# EAGLE design StepperSynth2.4_Motor (EAGLE 9.3.1)
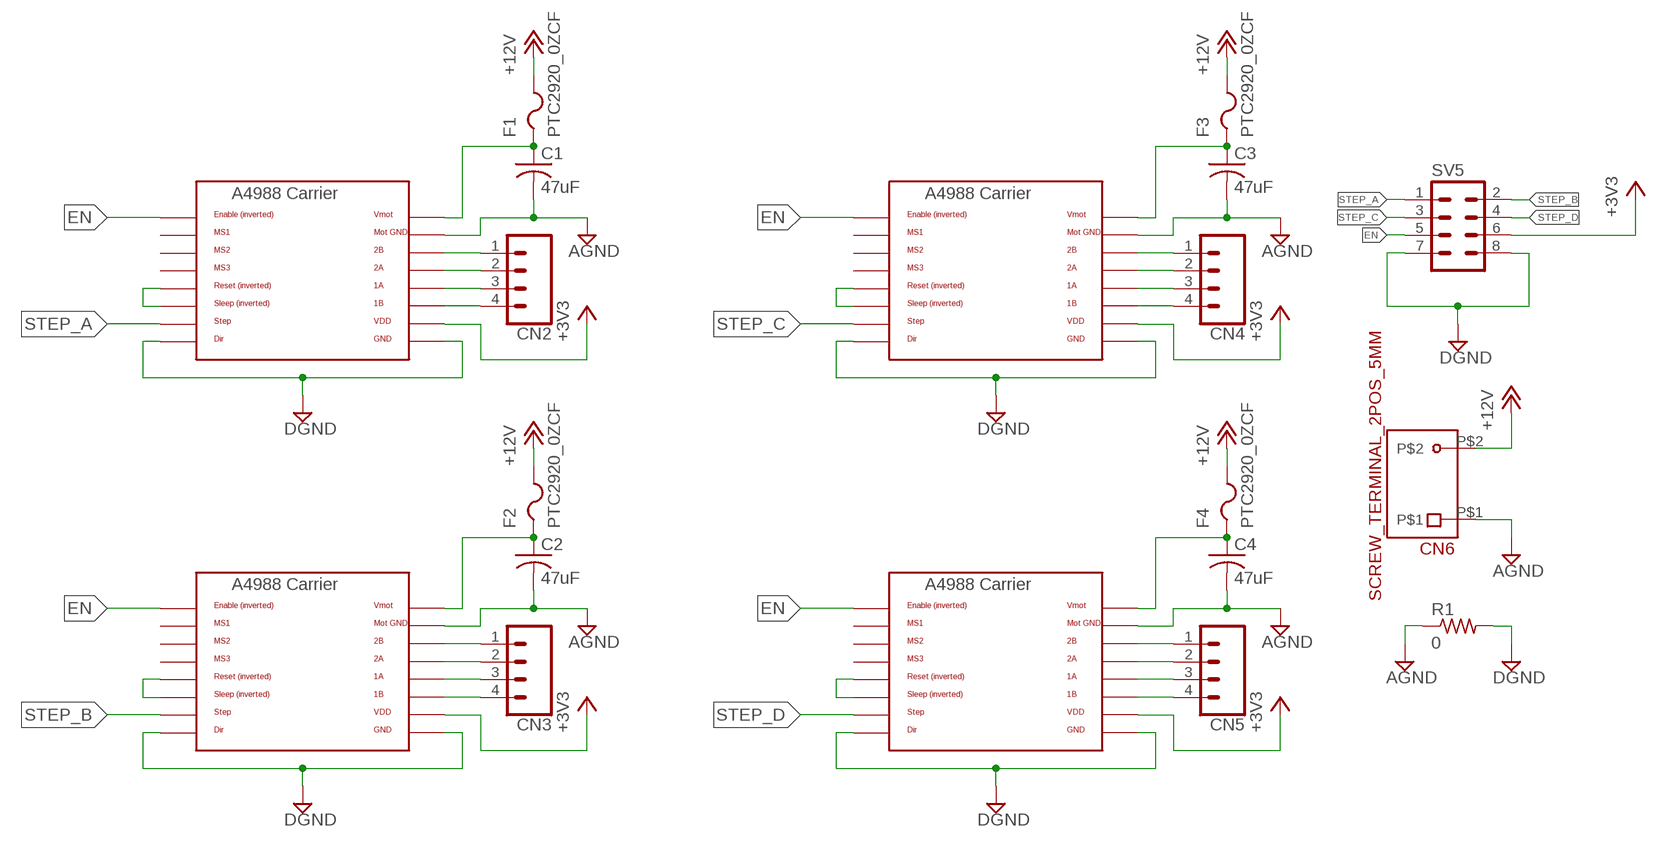
[diagram p0: schematic, sheet 1]

## Parts
C1  47uF  C_US_5_10  [E5-10]
C2  47uF  C_US_5_10  [E5-10]
C3  47uF  C_US_5_10  [E5-10]
C4  47uF  C_US_5_10  [E5-10]
CN2  CONN_04_LOCK  [1X04_LOCK_LONGPADS]
CN3  CONN_04_LOCK  [1X04_LOCK_LONGPADS]
CN4  CONN_04_LOCK  [1X04_LOCK_LONGPADS]
CN5  CONN_04_LOCK  [1X04_LOCK_LONGPADS]
CN6  SCREW_TERMINAL_2POS_5MM  [2_POS_SCREW_TERM]
F1  PTC2920_0ZCF  [0ZCF]
F2  PTC2920_0ZCF  [0ZCF]
F3  PTC2920_0ZCF  [0ZCF]
F4  PTC2920_0ZCF  [0ZCF]
R1  0  R-US_0207/15  [0207/15]
SV5  CONN_4X2_LOCK4X2_LOCK  [CONN_4X2_LOCK]
U$1  A4988BREAKOUT  [A4988BREAKOUT]
U$2  A4988BREAKOUT  [A4988BREAKOUT]
U$3  A4988BREAKOUT  [A4988BREAKOUT]
U$4  A4988BREAKOUT  [A4988BREAKOUT]

## Nets
+3V3: SV5.6 U$1.VDD U$2.VDD U$3.VDD U$4.VDD
+12V: CN6.P$2 F1.2 F2.2 F3.2 F4.2
AGND: C1.- C2.- C3.- C4.- CN6.P$1 R1.1 U$1.MOTGND U$2.MOTGND U$3.MOTGND U$4.MOTGND
DGND: R1.2 SV5.7 SV5.8 U$1.DIR U$1.GND U$2.DIR U$2.GND U$3.DIR U$3.GND U$4.DIR U$4.GND
EN: SV5.5 U$1.EN U$2.EN U$3.EN U$4.EN
N$1: CN2.1 U$1.2B
N$2: CN2.2 U$1.2A
N$3: CN2.3 U$1.1A
N$4: CN2.4 U$1.1B
N$5: U$1.RST U$1.SLP(SLEEP)
N$6: C1.+ F1.1 U$1.VMOT
N$7: CN3.1 U$2.2B
N$8: CN3.2 U$2.2A
N$9: CN3.3 U$2.1A
N$10: CN3.4 U$2.1B
N$11: U$2.RST U$2.SLP(SLEEP)
N$12: C2.+ F2.1 U$2.VMOT
N$13: CN4.1 U$3.2B
N$14: CN4.2 U$3.2A
N$15: CN4.3 U$3.1A
N$16: CN4.4 U$3.1B
N$17: U$3.RST U$3.SLP(SLEEP)
N$18: C3.+ F3.1 U$3.VMOT
N$19: CN5.1 U$4.2B
N$20: CN5.2 U$4.2A
N$21: CN5.3 U$4.1A
N$22: CN5.4 U$4.1B
N$23: U$4.RST U$4.SLP(SLEEP)
N$24: C4.+ F4.1 U$4.VMOT
STEP_A: SV5.1 U$1.STEP
STEP_B: SV5.2 U$2.STEP
STEP_C: SV5.3 U$3.STEP
STEP_D: SV5.4 U$4.STEP
Unconnected: U$1.MS1 U$1.MS2 U$1.MS3 U$2.MS1 U$2.MS2 U$2.MS3 U$3.MS1 U$3.MS2 U$3.MS3 U$4.MS1 U$4.MS2 U$4.MS3

## Library data of the parts
C1-C4 = Stepper Synth 2.4:C_US_5_10: Capacitor 5mm lead Spacing, 10mm Diameter
CN2-CN5 = Stepper Synth 2.4:CONN_04_LOCK
CN6 = Stepper Synth 2.4:SCREW_TERMINAL_2POS_5MM: 2 position screw terminal. 5mm spacing Digikey PN ED2561-ND
F1-F4 = Stepper Synth 2.4:PTC2920_0ZCF; MANUFACTURER_PART_NUMBER: 0ZCF0150FF2C; VENDOR: Belfuse
R1 = adafruit:R-US_: RESISTOR, American symbol
SV5 = Stepper Synth 2.4:CONN_4X2_LOCK
U$1-U$4 = Stepper Synth 2.4:A4988BREAKOUT

## Board
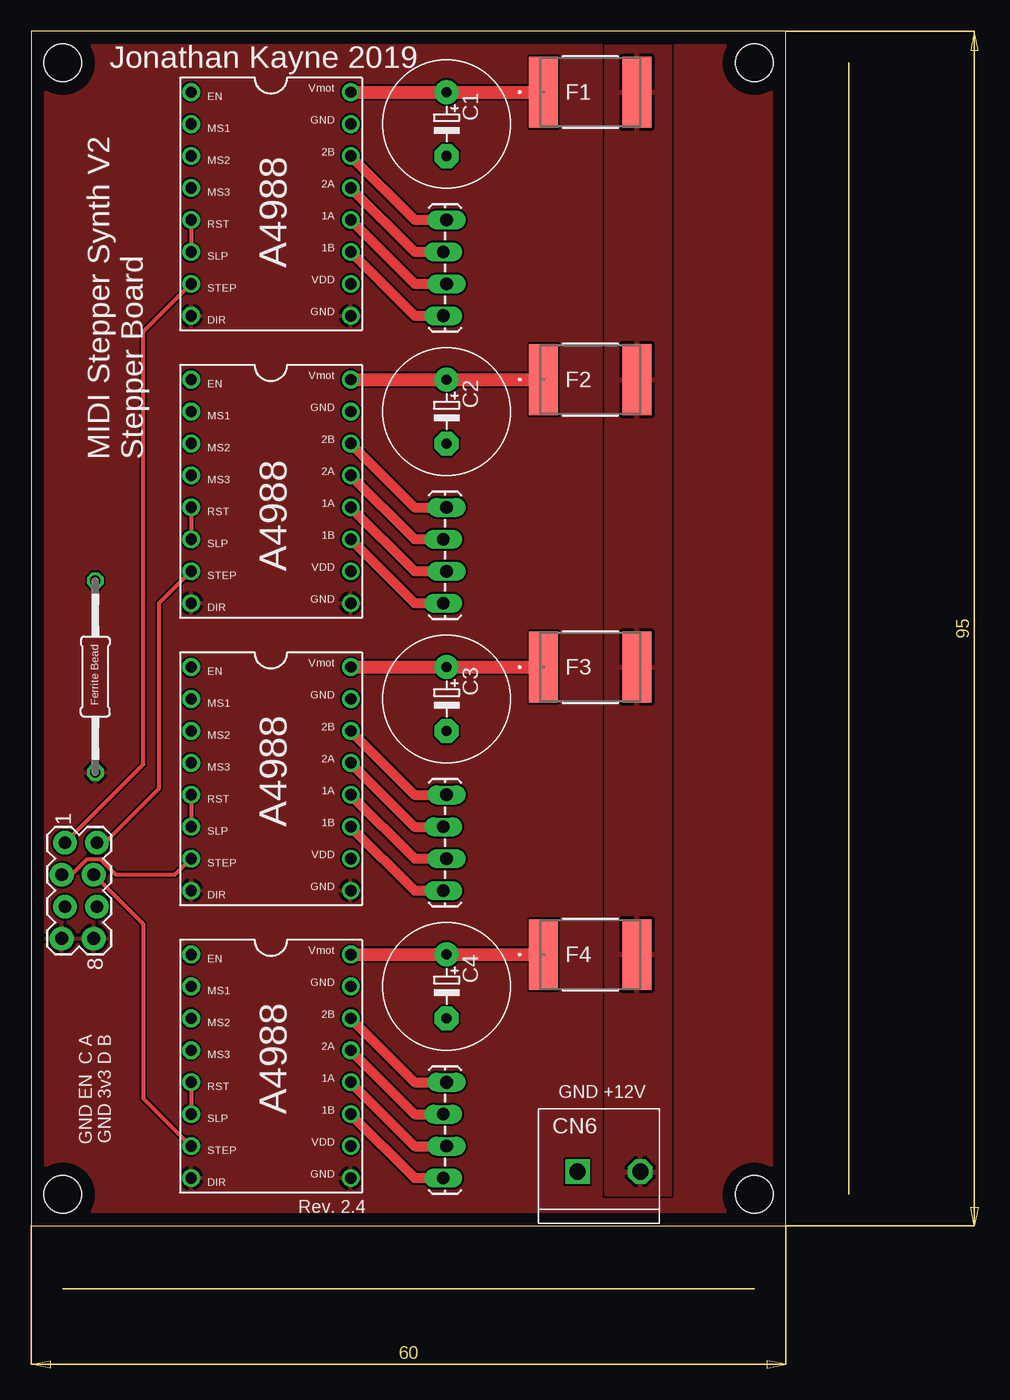
[diagram p1: board, top side]
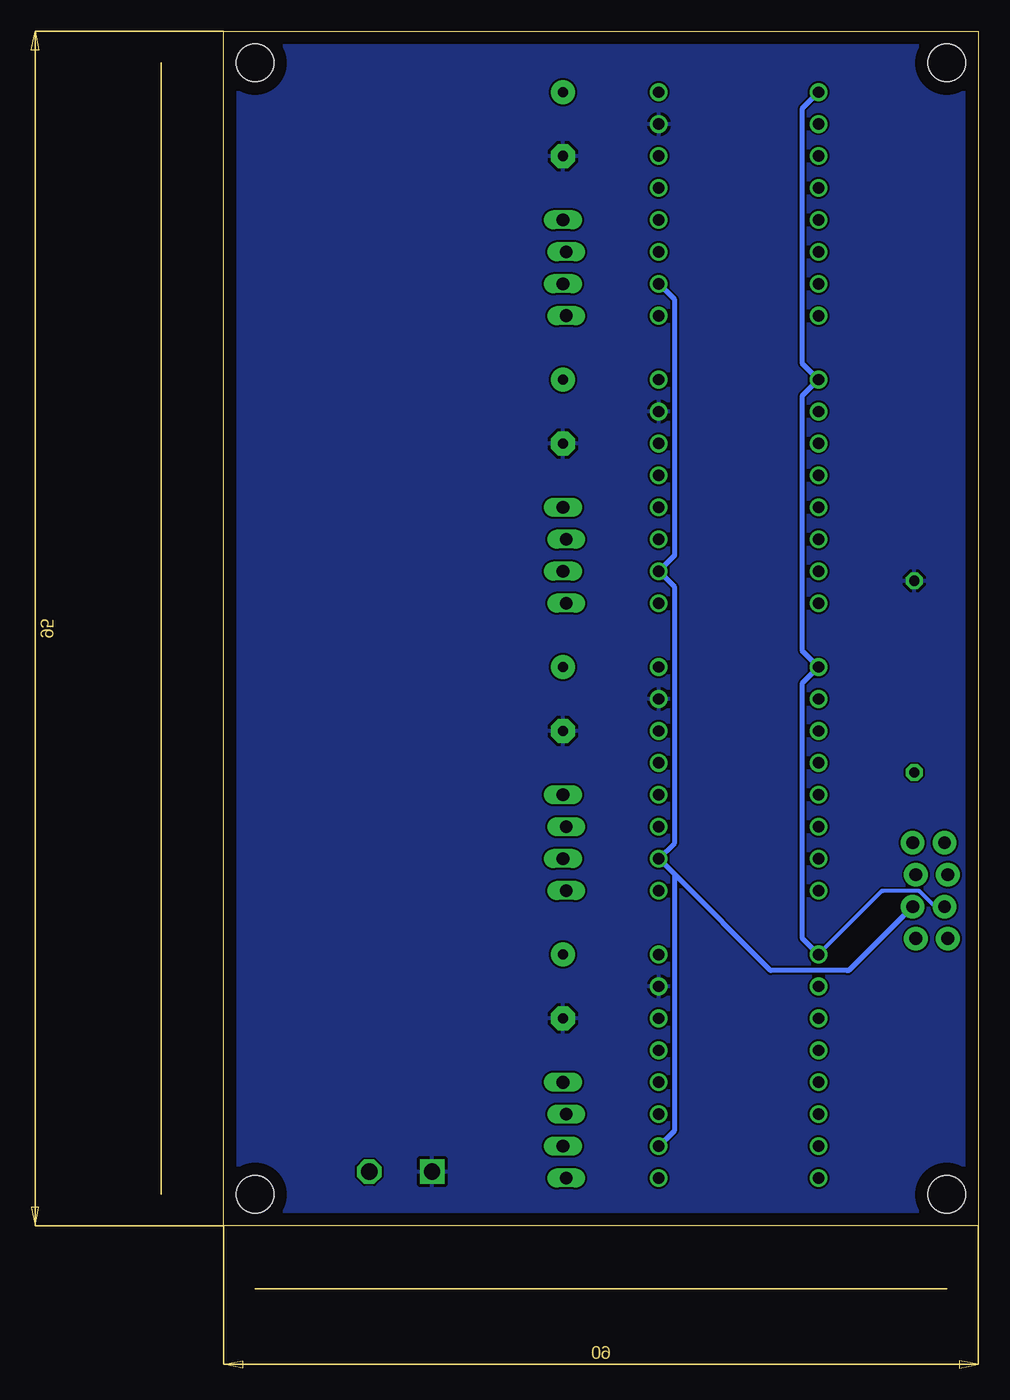
[diagram p2: board, bottom side, seen from below]

Size 60 x 95 mm. Coordinates in mm from the lower left corner, seen from the top.
Outline: 0,0 60,0 60,95 0,95 0,0
Copper layers (1*16): Top 0.035mm / dielectric 1.5mm / Bottom 0.035mm
Design rules "default": minimum track width 6mil, minimum drill 0.35mm, track to track 6mil, track to pad 6mil, pad to pad 6mil, via to via 6mil, smd to smd 6mil, copper to edge 40mil, drill to drill 6mil, minimum pad ring 10mil, minimum via ring 8mil, stop-mask expansion 4mil, vias tented up to drill 0mil, thermal gap 10mil
Holes 3 mm at 2.5,2.5 57.5,2.5 2.5,92.5 57.5,92.5

### Footprints (pad centres in the part's own frame; a part is rotated, then mirrored left to right if it is on the bottom)
E5-10 = drill 0.813 pad 1.905: + -2.54,0 | drill 0.813 pad 1.905 octagon: - 2.54,0
1X04_LOCK_LONGPADS = drill 1.016 long: 1 0,0; 2 2.54,-0.254; 3 5.08,0; 4 7.62,-0.254
2_POS_SCREW_TERM = drill 1.3 square: P$1 0,0 | drill 1.3 octagon: P$2 5,0
0ZCF = smd 2.311 x 5.613: 1 -3.708,0; 2 3.708,0
0207/15 = drill 0.813 octagon: 1 -7.62,0; 2 7.62,0
CONN_4X2_LOCK = drill 1.016 pad 1.88: 1 -3.81,-1.143; 2 -3.81,1.397; 3 -1.27,-1.397; 4 -1.27,1.143; 5 1.27,-1.143; 6 1.27,1.397; 7 3.81,-1.397; 8 3.81,1.143
A4988BREAKOUT = drill 0.9: 1A 8.89,1.27; 1B 11.43,1.27; 2A 6.35,1.27; 2B 3.81,1.27; DIR 16.51,-11.43; EN -1.27,-11.43; GND 16.51,1.27; MOTGND 1.27,1.27; MS1 1.27,-11.43; MS2 3.81,-11.43; MS3 6.35,-11.43; RST 8.89,-11.43; SLP 11.43,-11.43; STEP 13.97,-11.43; VDD 13.97,1.27; VMOT -1.27,1.27

### Placement (x,y rotation side)
C1  33.02,87.63 270 top
C2  33.02,64.77 270 top
C3  33.02,41.91 270 top
C4  33.02,19.05 270 top
CN2  33.02,80.01 270 top
CN3  33.02,57.15 270 top
CN4  33.02,34.29 270 top
CN5  33.02,11.43 270 top
CN6  43.43,4.32 0 top
F1  44.45,90.17 0 top
F2  44.45,67.31 0 top
F3  44.45,44.45 0 top
F4  44.45,21.59 0 top
R1  5.08,43.69 270 top
SV5  3.81,26.67 270 top
U$1  24.13,88.9 270 top
U$2  24.13,66.04 270 top
U$3  24.13,43.18 270 top
U$4  24.13,20.32 270 top

### Tracks (layer width: path | path; a pad name or v marks a point on that pad's centre or on a via)
+3V3
  Bottom 0.305: 10.29,20.32 10.41,20.32
  Bottom 0.406: U$4.VDD 24.13,7.62 24.13,27.94 | 24.13,27.94 U$3.VDD 24.13,30.48 24.13,50.8 U$2.VDD 24.13,53.34 24.13,73.66 U$1.VDD | 24.13,27.94 16.51,20.32 10.41,20.32 | SV5.6 10.29,20.32
+12V
  pour Top (rank 2): 45.72,2.54 50.8,2.54 50.8,93.98 45.72,93.98
AGND
  pour Bottom: -1.27,96.52 62.23,96.52 62.23,-1.27 -1.27,-1.27
DGND
  pour Top (rank 4): -1.27,96.52 60.96,96.52 60.96,-1.27 -1.27,-1.27
EN
  Bottom 0.305: SV5.5 3.45,25.4 4.69,26.64 7.59,26.64 7.62,26.67 U$4.EN
  Bottom 0.406: U$4.EN 13.97,22.86 13.97,43.18 U$3.EN 13.97,45.72 13.97,66.04 U$2.EN 13.97,68.58 13.97,88.9 U$1.EN
N$1
  Top 0.813: U$1.2B 30.48,80.01 CN2.1
N$2
  Top 0.813: U$1.2A 30.48,77.47 CN2.2
N$3
  Top 0.813: U$1.1A 30.48,74.93 CN2.3
N$4
  Top 0.813: U$1.1B 30.48,72.39 CN2.4
N$5
  Top 0.305: U$1.RST U$1.SLP
N$6
  Top 1.016: U$1.VMOT C1.+ F1.1
N$7
  Top 0.813: U$2.2B 30.48,57.15 CN3.1
N$8
  Top 0.813: U$2.2A 30.48,54.61 CN3.2
N$9
  Top 0.813: U$2.1A 30.48,52.07 CN3.3
N$10
  Top 0.813: U$2.1B 30.48,49.53 CN3.4
N$11
  Top 0.305: U$2.RST U$2.SLP
N$12
  Top 1.016: U$2.VMOT C2.+ F2.1
N$13
  Top 0.813: U$3.2B 30.48,34.29 CN4.1
N$14
  Top 0.813: U$3.2A 30.48,31.75 CN4.2
N$15
  Top 0.813: U$3.1A 30.48,29.21 CN4.3
N$16
  Top 0.813: U$3.1B 30.48,26.67 CN4.4
N$17
  Top 0.305: U$3.RST U$3.SLP
N$18
  Top 1.016: U$3.VMOT C3.+ F3.1
N$19
  Top 0.813: U$4.2B 30.48,11.43 CN5.1
N$20
  Top 0.813: U$4.2A 30.48,8.89 CN5.2
N$21
  Top 0.813: U$4.1A 30.48,6.35 CN5.3
N$22
  Top 0.813: U$4.1B 30.48,3.81 CN5.4
N$23
  Top 0.305: U$4.RST U$4.SLP
N$24
  Top 1.016: U$4.VMOT C4.+ F4.1
STEP_A
  Top 0.305: U$1.STEP 8.89,71.12 8.89,36.7 SV5.1
STEP_B
  Top 0.305: U$2.STEP 10.16,49.53 10.16,34.8 5.84,30.48 SV5.2
STEP_C
  Top 0.305: U$3.STEP 11.43,27.94 6.71,27.94 5.47,29.18 4.44,29.18 3.19,27.94 SV5.3
STEP_D
  Top 0.305: U$4.STEP 8.89,10.16 8.89,24 SV5.4

### Text on the board
tNames: Jonathan Kayne 2019 | A4988 | MIDI Stepper Synth V2 / Stepper Board | A4988 | Ferrite Bead | A4988 | GND EN C A / GND 3v3 D B | GND +12V | A4988 | Rev. 2.4